# EAGLE board DLT_Jetson_Nano (EAGLE 9.4.2)
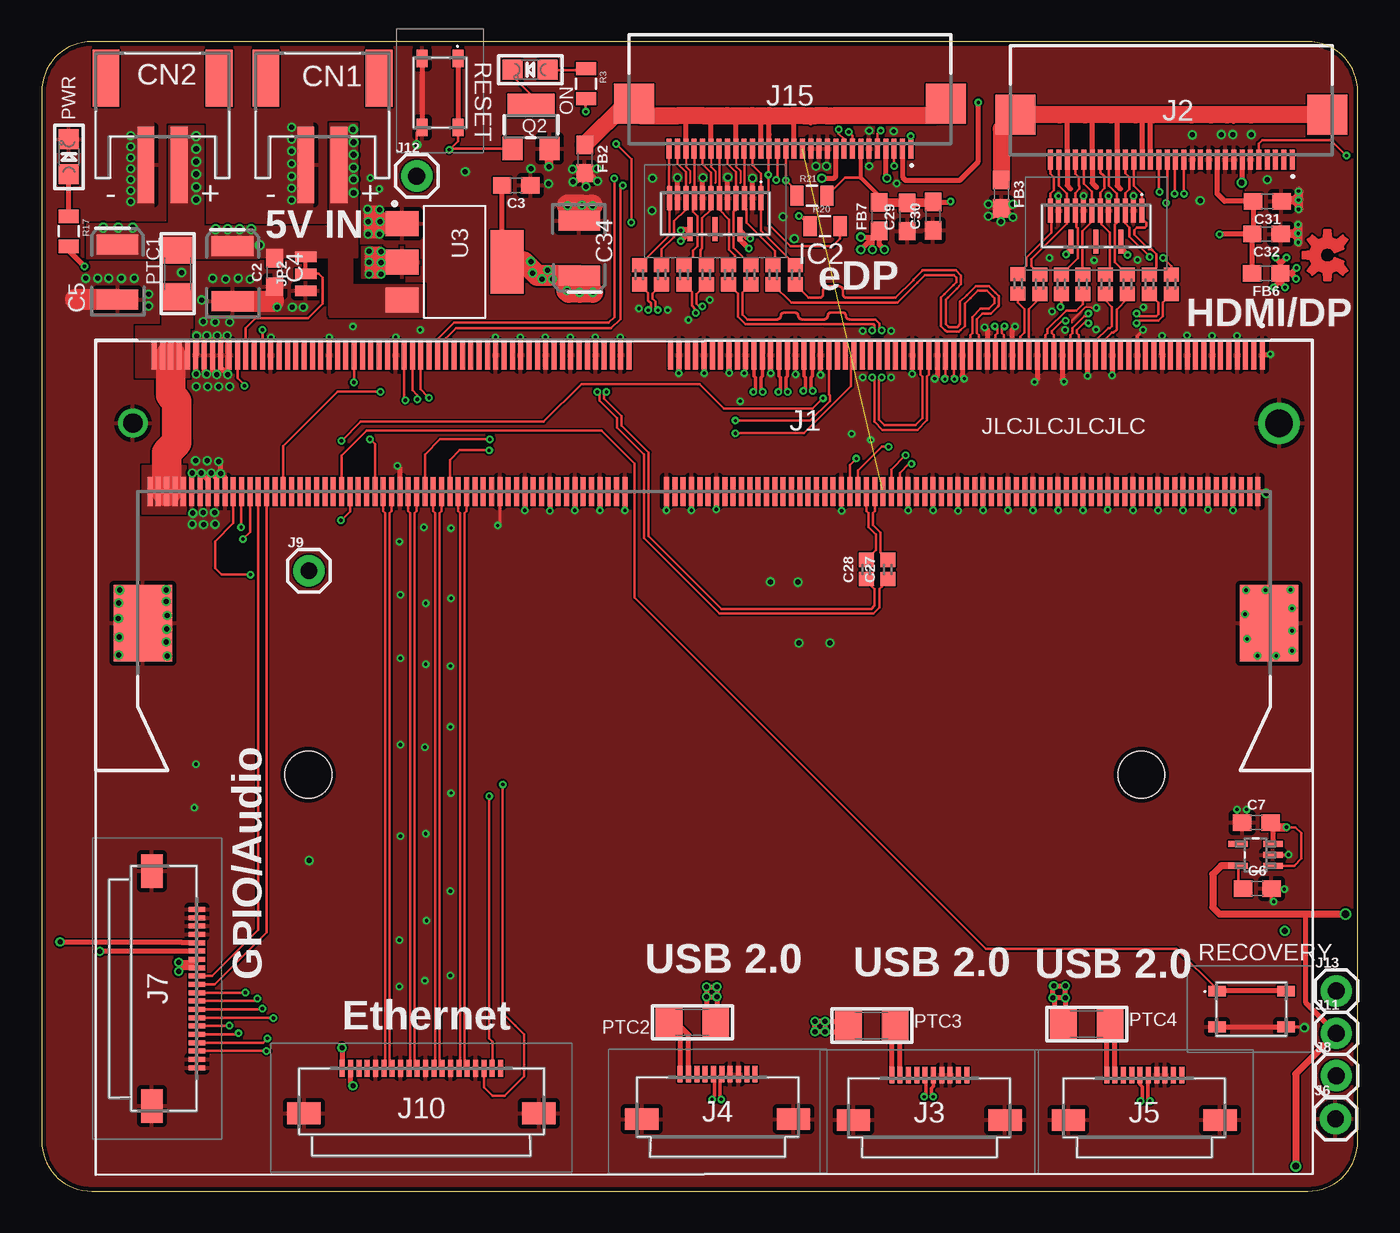
[diagram p2: board, top side]
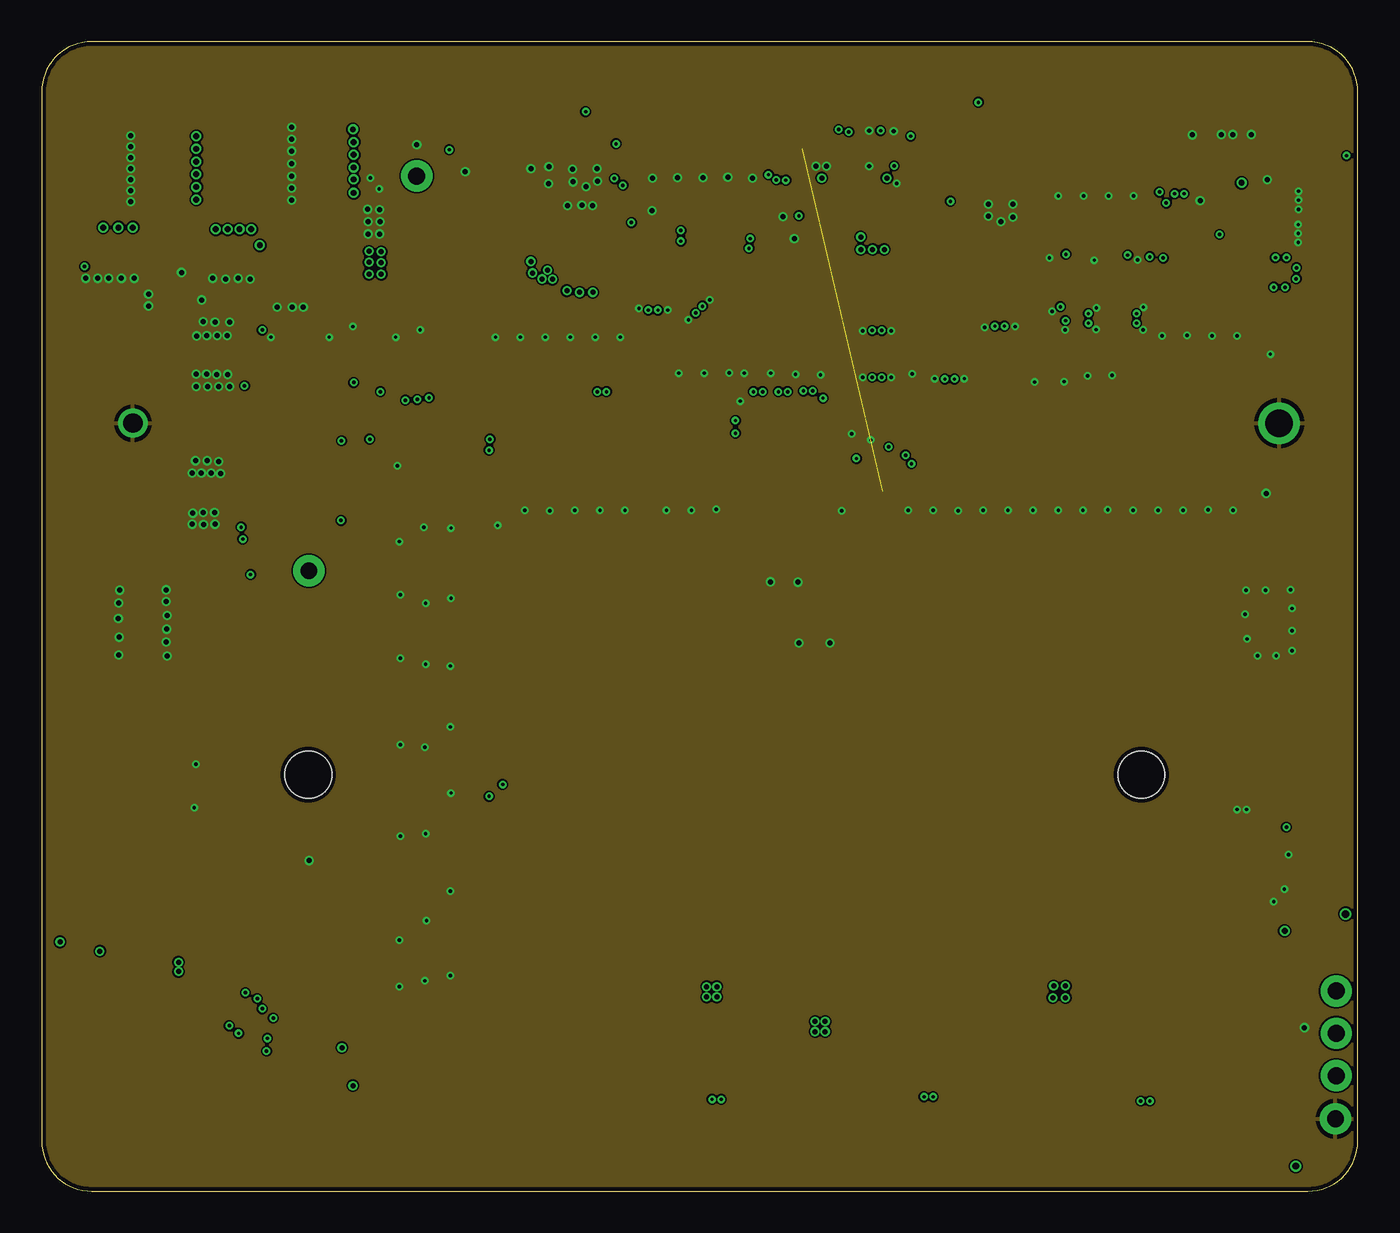
[diagram p3: board, inner layer Route2]
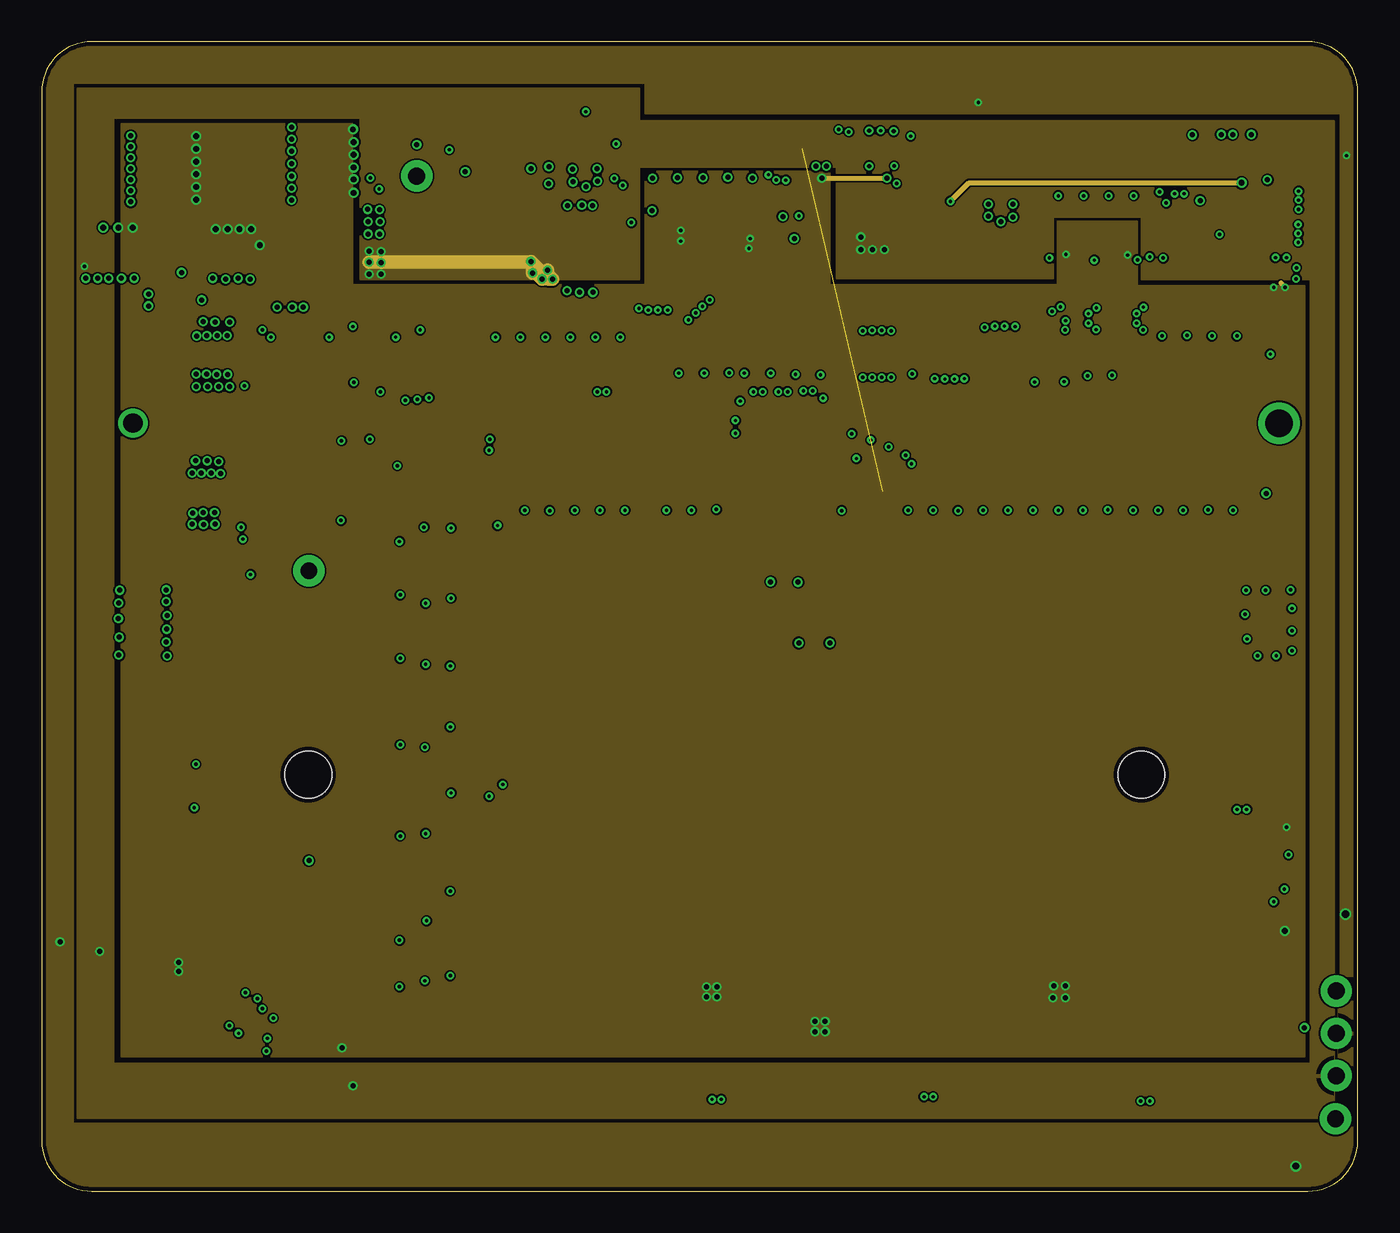
[diagram p4: board, inner layer Route15]
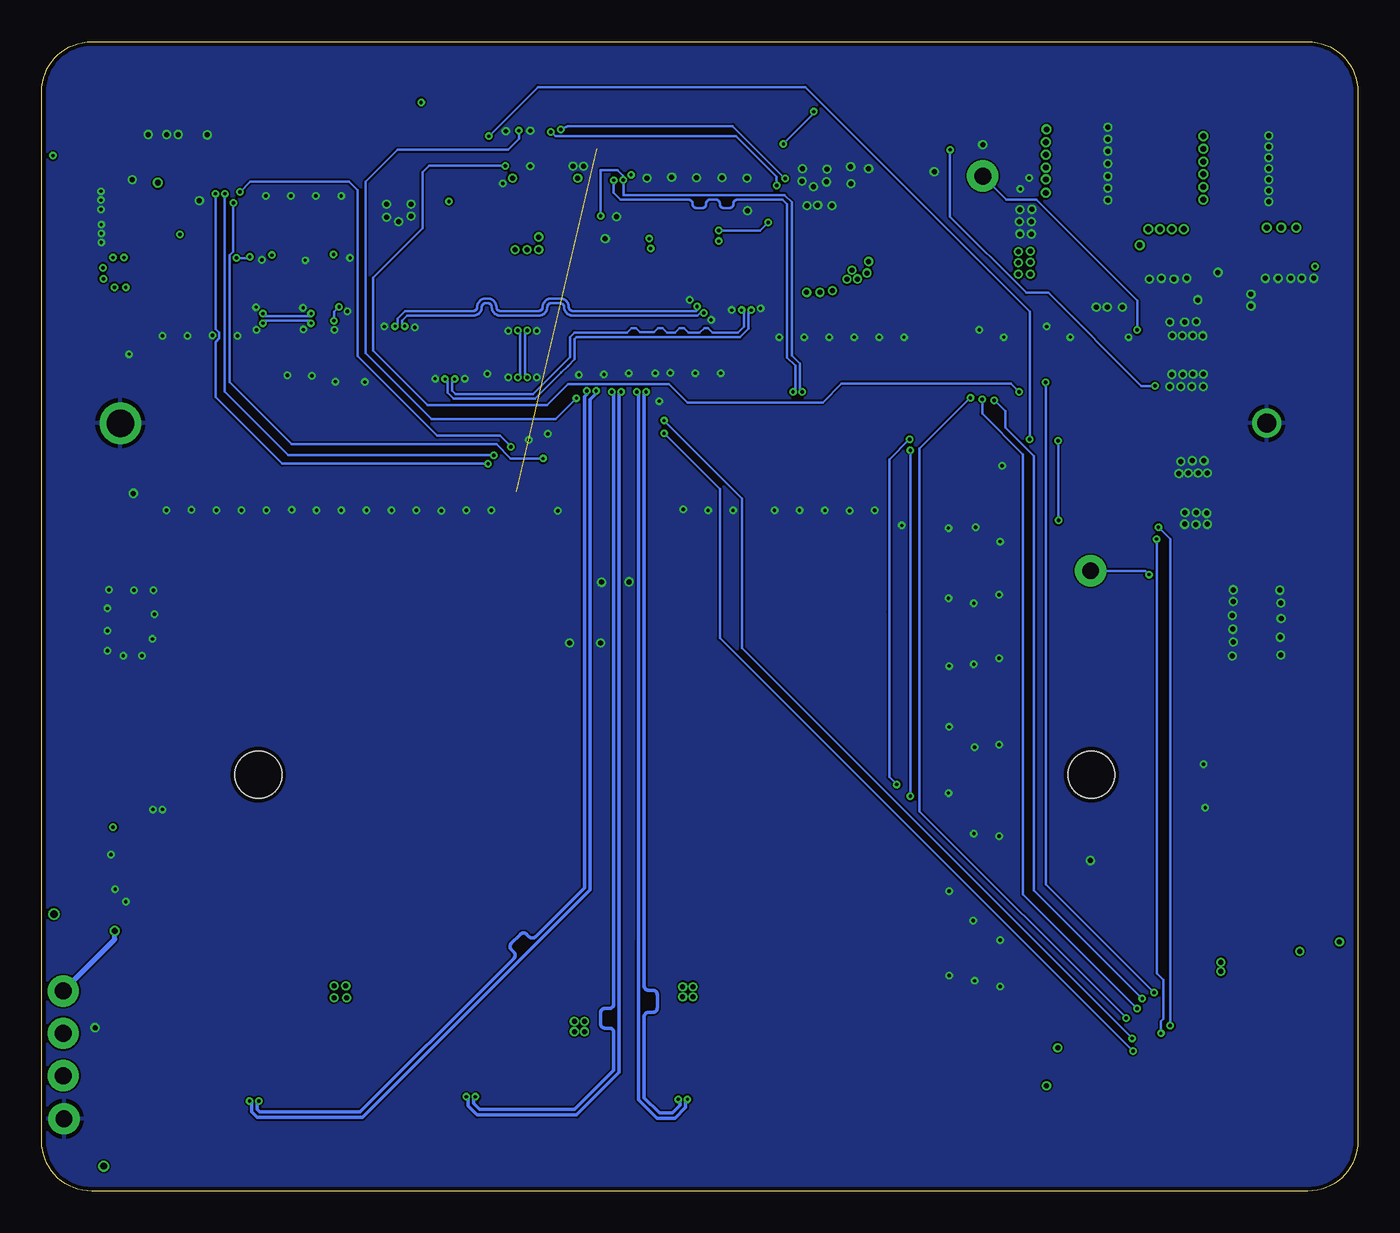
[diagram p5: board, bottom side, seen from below]

Size 79 x 69 mm. Coordinates in mm from the lower left corner, seen from the top.
Outline: 76,69 3,69 arc90 0,66 0,3 arc90 3,0 76,0 arc90 79,3 79,66 arc90 76,69
Copper layers (1+2*15+16): Top 0.035mm / dielectric 0.2mm / Route2 0.0175mm / dielectric 0.265mm / Route15 0.0175mm / dielectric 0.2mm / Bottom 0.035mm
Design rules "SeeedStudio_2layer_DRU_no_angle_20140221 *": minimum track width 4mil, minimum drill 0.2mm, track to track 4mil, track to pad 4mil, pad to pad 4mil, via to via 4mil, smd to smd 0mil, copper to edge 10mil, drill to drill 10mil, minimum pad ring 10mil, minimum via ring 0.125mm, stop-mask expansion 2mil, vias tented up to drill 100mil, thermal gap 10mil
Holes 2.8 mm at 16,25 66,25

## Footprints (pad centres in the part's own frame; a part is rotated, then mirrored left to right if it is on the bottom)
0603 = smd 1.1 x 1: 1 -0.85,0; 2 0.85,0
EIA3528 = smd 1.2 x 2.5: A 1.65,0; C -1.65,0
0402 = smd 0.85 x 0.9: 1 -0.58,0; 2 0.58,0
JST-PH-2-SMT-RA = smd 1 x 4.6: 1 1,-3.7; 2 -1,-3.7 | smd 1.6 x 3.4: NC1 -3.4,1.5; NC2 3.4,1.5
TPD8S009DSMR = smd 0.3 x 1.45: 1 2.75,0.775; 2 2.25,0.775; 3 1.75,0.775; 4 1.25,0.775; 5 0.75,0.775; 6 0.25,0.775; 7 -0.25,0.775; 8 -0.75,0.775; 9 -1.25,0.775; 10 -1.75,0.775; 11 -2.25,0.775; 12 -2.75,0.775; 13 -1.5,-1.075; 14 0,-1.075; 15 1.5,-1.075
SOT65P210X110-5N = smd 1.168 x 0.356: 1 -1.041,0.66; 2 -1.041,0; 3 -1.041,-0.66; 4 1.041,-0.66; 5 1.041,0.66
2309409-1 = smd 0.3 x 1.75: 1 38.25,8.2; 2 38,0; 3 37.75,8.2; 4 37.5,0; 5 37.25,8.2; 6 37,0; 7 36.75,8.2; 8 36.5,0; 9 36.25,8.2; 10 36,0; 11 35.75,8.2; 12 35.5,0; 13 35.25,8.2; 14 35,0; 15 34.75,8.2; 16 34.5,0; 17 34.25,8.2; 18 34,0; 19 33.75,8.2; 20 33.5,0; 21 33.25,8.2; 22 33,0; 23 32.75,8.2; 24 32.5,0; 25 32.25,8.2; 26 32,0; 27 31.75,8.2; 28 31.5,0; 29 31.25,8.2; 30 31,0; 31 30.75,8.2; 32 30.5,0; 33 30.25,8.2; 34 30,0; 35 29.75,8.2; 36 29.5,0; 37 29.25,8.2; 38 29,0; 39 28.75,8.2; 40 28.5,0; 41 28.25,8.2; 42 28,0; 43 27.75,8.2; 44 27.5,0; 45 27.25,8.2; 46 27,0; 47 26.75,8.2; 48 26.5,0; 49 26.25,8.2; 50 26,0; 51 25.75,8.2; 52 25.5,0; 53 25.25,8.2; 54 25,0; 55 24.75,8.2; 56 24.5,0; 57 24.25,8.2; 58 24,0; 59 23.75,8.2; 60 23.5,0; 61 23.25,8.2; 62 23,0; 63 22.75,8.2; 64 22.5,0; 65 22.25,8.2; 66 22,0; 67 21.75,8.2; 68 21.5,0; 69 21.25,8.2; 70 21,0; 71 20.75,8.2; 72 20.5,0; 73 20.25,8.2; 74 20,0; 75 19.75,8.2; 76 19.5,0; 77 19.25,8.2; 78 19,0; 79 18.75,8.2; 80 18.5,0; 81 18.25,8.2; 82 18,0; 83 17.75,8.2; 84 17.5,0; 85 17.25,8.2; 86 17,0; 87 16.75,8.2; 88 16.5,0; 89 16.25,8.2; 90 16,0; 91 15.75,8.2; 92 15.5,0; 93 15.25,8.2; 94 15,0; 95 14.75,8.2; 96 14.5,0; 97 14.25,8.2; 98 14,0; 99 13.75,8.2; 100 13.5,0; 101 13.25,8.2; 102 13,0; 103 12.75,8.2; 104 12.5,0; 105 12.25,8.2; 106 12,0; 107 11.75,8.2; 108 11.5,0; 109 11.25,8.2; 110 11,0; 111 10.75,8.2; 112 10.5,0; 113 10.25,8.2; 114 10,0; 115 9.75,8.2; 116 9.5,0; 117 9.25,8.2; 118 9,0; 119 8.75,8.2; 120 8.5,0; 121 8.25,8.2; 122 8,0; 123 7.75,8.2; 124 7.5,0; 125 7.25,8.2; 126 7,0; 127 6.75,8.2; 128 6.5,0; 129 6.25,8.2; 130 6,0; 131 5.75,8.2; 132 5.5,0; 133 5.25,8.2; 134 5,0; 135 4.75,8.2; 136 4.5,0; 137 4.25,8.2; 138 4,0; 139 3.75,8.2; 140 3.5,0; 141 3.25,8.2; 142 3,0; 143 2.75,8.2; 144 2.5,0; 145 0.25,8.2; 146 0,0; 147 -0.25,8.2; 148 -0.5,0; 149 -0.75,8.2; 150 -1,0; 151 -1.25,8.2; 152 -1.5,0; 153 -1.75,8.2; 154 -2,0; 155 -2.25,8.2; 156 -2.5,0; 157 -2.75,8.2; 158 -3,0; 159 -3.25,8.2; 160 -3.5,0; 161 -3.75,8.2; 162 -4,0; 163 -4.25,8.2; 164 -4.5,0; 165 -4.75,8.2; 166 -5,0; 167 -5.25,8.2; 168 -5.5,0; 169 -5.75,8.2; 170 -6,0; 171 -6.25,8.2; 172 -6.5,0; 173 -6.75,8.2; 174 -7,0; 175 -7.25,8.2; 176 -7.5,0; 177 -7.75,8.2; 178 -8,0; 179 -8.25,8.2; 180 -8.5,0; 181 -8.75,8.2; 182 -9,0; 183 -9.25,8.2; 184 -9.5,0; 185 -9.75,8.2; 186 -10,0; 187 -10.25,8.2; 188 -10.5,0; 189 -10.75,8.2; 190 -11,0; 191 -11.25,8.2; 192 -11.5,0; 193 -11.75,8.2; 194 -12,0; 195 -12.25,8.2; 196 -12.5,0; 197 -12.75,8.2; 198 -13,0; 199 -13.25,8.2; 200 -13.5,0; 201 -13.75,8.2; 202 -14,0; 203 -14.25,8.2; 204 -14.5,0; 205 -14.75,8.2; 206 -15,0; 207 -15.25,8.2; 208 -15.5,0; 209 -15.75,8.2; 210 -16,0; 211 -16.25,8.2; 212 -16.5,0; 213 -16.75,8.2; 214 -17,0; 215 -17.25,8.2; 216 -17.5,0; 217 -17.75,8.2; 218 -18,0; 219 -18.25,8.2; 220 -18.5,0; 221 -18.75,8.2; 222 -19,0; 223 -19.25,8.2; 224 -19.5,0; 225 -19.75,8.2; 226 -20,0; 227 -20.25,8.2; 228 -20.5,0; 229 -20.75,8.2; 230 -21,0; 231 -21.25,8.2; 232 -21.5,0; 233 -21.75,8.2; 234 -22,0; 235 -22.25,8.2; 236 -22.5,0; 237 -22.75,8.2; 238 -23,0; 239 -23.25,8.2; 240 -23.5,0; 241 -23.75,8.2; 242 -24,0; 243 -24.25,8.2; 244 -24.5,0; 245 -24.75,8.2; 246 -25,0; 247 -25.25,8.2; 248 -25.5,0; 249 -25.75,8.2; 250 -26,0; 251 -26.25,8.2; 252 -26.5,0; 253 -26.75,8.2; 254 -27,0; 255 -27.25,8.2; 256 -27.5,0; 257 -27.75,8.2; 258 -28,0; 259 -28.25,8.2; 260 -28.5,0 | drill 1.65 pad 2.5: 261 39.275,4.1 | drill 1.15 pad 1.75: 262 -29.525,4.1 | smd 3.5 x 4.6: 263 38.675,-7.9; 264 -28.925,-7.9
54132-3062 = smd 0.3 x 1.2: 1 -7.25,0.3; 2 -6.75,0.3; 3 -6.25,0.3; 4 -5.75,0.3; 5 -5.25,0.3; 6 -4.75,0.3; 7 -4.25,0.3; 8 -3.75,0.3; 9 -3.25,0.3; 10 -2.75,0.3; 11 -2.25,0.3; 12 -1.75,0.3; 13 -1.25,0.3; 14 -0.75,0.3; 15 -0.25,0.3; 16 0.25,0.3; 17 0.75,0.3; 18 1.25,0.3; 19 1.75,0.3; 20 2.25,0.3; 21 2.75,0.3; 22 3.25,0.3; 23 3.75,0.3; 24 4.25,0.3; 25 4.75,0.3; 26 5.25,0.3; 27 5.75,0.3; 28 6.25,0.3; 29 6.75,0.3; 30 7.25,0.3 | smd 2.4 x 2.4: 31 -9.35,-2.4; 32 9.35,-2.4
5051101092 = smd 0.3 x 1: 1 -2.25,2.475; 2 -1.75,2.475; 3 -1.25,2.475; 4 -0.75,2.475; 5 -0.25,2.475; 6 0.25,2.475; 7 0.75,2.475; 8 1.25,2.475; 9 1.75,2.475; 10 2.25,2.475 | smd 2 x 1.3: 11 -4.55,-0.225; 12 4.55,-0.225
1X01 = drill 1.016 pad 1.88: 1 0,0
5051102091 = smd 0.3 x 1: 1 -4.75,2.625; 2 -4.25,2.625; 3 -3.75,2.625; 4 -3.25,2.625; 5 -2.75,2.625; 6 -2.25,2.625; 7 -1.75,2.625; 8 -1.25,2.625; 9 -0.75,2.625; 10 -0.25,2.625; 11 0.25,2.625; 12 0.75,2.625; 13 1.25,2.625; 14 1.75,2.625; 15 2.25,2.625; 16 2.75,2.625; 17 3.25,2.625; 18 3.75,2.625; 19 4.25,2.625; 20 4.75,2.625 | smd 2 x 1.3: MP1 -7.05,-0.075; MP2 7.05,-0.075
SMT-JUMPER_3_1-NC_TRACE_NO-SILK = smd 0.635 x 1.27: 1 -1.016,0; 2 0,0; 3 1.016,0
CHIPLED_0805 = smd 1.2 x 1.2: A 0,-1.05; C 0,1.05
1206 = smd 1.6 x 1.8: 1 -1.4,0; 2 1.4,0
SOT23-W = smd 1.2 x 1.4: 1 -1.1,-1.3; 2 1.1,-1.3 | smd 2.8 x 1.4: 3 0,1.3
0805 = smd 0.8 x 1.2: 1 -0.9,0; 2 0.9,0
SKRPADE010 = smd 1.05 x 0.65: 1 -1.95,1.075; 2 2.2,1.075; 3 -1.95,-1.075; 4 2.2,-1.075
SOT230P700X180-4N = smd 1.5 x 2: 1 -2.3,-3.15; 2 0,-3.15; 3 2.3,-3.15 | smd 3.8 x 2: 4 0,3.15

## Placement (x,y rotation side)
C2  1uF  [0603]  13.98,55.15 90 top
C3  4.7uF  [0603]  28.48,60.38 180 top
C4  47uF  [EIA3528]  11.47,55.07 90 top
C5  47uF  [EIA3528]  4.56,55.17 90 top
C6  1uF  [0603]  72.96,18.16 0 top
C7  4.7uF  [0603]  72.91,22.13 0 top
C10  0.1uF  [0402]  59.9,54.44 90 top
C11  0.1uF  [0402]  58.61,54.46 90 top
C12  0.1uF  [0402]  62.5,54.44 90 top
C13  0.1uF  [0402]  61.2,54.44 90 top
C14  0.1uF  [0402]  65.16,54.44 90 top
C15  0.1uF  [0402]  63.84,54.44 90 top
C16  0.1uF  [0402]  66.48,54.44 90 top
C17  0.1uF  [0402]  67.8,54.44 90 top
C18  0.1uF  [0402]  43.91,55.01 90 top
C19  0.1uF  [0402]  45.25,55.01 90 top
C20  0.1uF  [0402]  41.23,55.01 90 top
C21  0.1uF  [0402]  42.57,55.01 90 top
C22  0.1uF  [0402]  38.55,55.01 90 top
C23  0.1uF  [0402]  39.89,55.01 90 top
C24  0.1uF  [0402]  35.88,55.01 90 top
C25  0.1uF  [0402]  37.22,55.01 90 top
C27  0.1uF  [0402]  50.79,37.32 90 top
C28  0.1uF  [0402]  49.49,37.32 90 top
C29  4.7uF  [0603]  51.95,58.47 90 top
C30  4.7uF  [0603]  53.5,58.52 90 top
C31  4.7uF  [0603]  73.57,59.41 180 top
C32  4.7uF  [0603]  73.52,57.46 180 top
C34  47uF  [EIA3528]  32.27,56.62 270 top
CN1  [JST-PH-2-SMT-RA]  16.85,65.31 0 top
CN2  [JST-PH-2-SMT-RA]  7.25,65.31 0 top
FB2  .25/3A  [0603]  32.6,61.95 270 top
FB3  .25/3A  [0603]  57.59,59.85 270 top
FB6  .25/3A  [0603]  73.49,55.1 180 top
FB7  .25/3A  [0603]  50.28,58.5 90 top
IC1  TPD8S009DSMR  [TPD8S009DSMR]  63.29,58.07 0 top
IC2  TPD8S009DSMR  [TPD8S009DSMR]  40.42,58.83 0 top
IC3  TLV70018DCKR  [SOT65P210X110-5N]  72.86,20.2 180 top
J1  2309409-1  [2309409-1]  35,42 0 top
J2  54132-3062  [54132-3062]  67.8,62.21 180 top
J3  505110-1092  [5051101092]  53.28,4.5 0 top
J4  505110-1092  [5051101092]  40.58,4.55 0 top
J5  505110-1092  [5051101092]  66.18,4.5 0 top
J6  [1X01]  77.66,4.35 0 top
J7  505110-2091  [5051102091]  6.69,12.17 270 top
J8  [1X01]  77.71,6.94 0 top
J9  [1X01]  16.04,37.24 0 top
J10  505110-2091  [5051102091]  22.8,4.75 0 top
J11  [1X01]  77.71,9.48 0 top
J12  [1X01]  22.52,60.94 0 top
J13  [1X01]  77.71,12.02 0 top
J15  54132-3062  [54132-3062]  44.92,62.87 180 top
JP2  JUMPER-SMT_3_1-NC_TRACE_NO-SILK  [SMT-JUMPER_3_1-NC_TRACE_NO-SILK]  15.86,55.07 90 top
LOGO1  OSHW-LOGOS-COPPER  [OSHW-LOGO-S_COPPER]  77.18,56.19 90 top
ON  [CHIPLED_0805]  29.32,67.31 90 top
PTC1  [1206]  8.16,55.07 90 top
PTC2  [1206]  39.05,10.14 180 top
PTC3  [1206]  49.82,9.93 0 top
PTC4  [1206]  62.72,10.04 0 top
PWR  [CHIPLED_0805]  1.64,62.08 0 top
Q2  [SOT23-W]  29.37,63.88 0 top
R3  [0805]  32.68,66.47 270 top
R17  [0805]  1.64,57.61 270 top
R20  100k  [0805]  47.03,57.92 0 top
R21  100k  [0805]  46.24,59.74 0 top
S2  SKRPADE010  [SKRPADE010]  23.91,66.05 270 top
S4  SKRPADE010  [SKRPADE010]  72.49,10.94 0 top
U3  LDL1117S12R  [SOT230P700X180-4N]  24.78,55.78 270 top

## Tracks (layer width: path | path; a pad name or v marks a point on that pad's centre or on a via)
1.8V  (via drill 0.2, 0.3, 0.4, 0.45)
  Top 0.152: C6.1 71.82,18.46 IC3.5 | J2.5 73.05,62.89 73.27,63.1 77.38,63.1 v78.32,62.16
  Top 0.305: J7.5 8.45,14.92 8.43,14.93 1.1,14.93 v1.1,14.96 | J11.1 75.88,11.31 75.88,16.64 | J15.2 51.67,60.87 51.85,60.68 55.1,60.68 56.22,61.8 v56.22,65.36
  Top 0.406: IC3.5 70.8,19.54 70.29,19.03 70.29,17.05 70.7,16.64 75.88,16.64 v78.27,16.64 | J11.1 75.27,7.04 v75.27,1.5
  pour Route15: 77.96,12.93 77.96,64.7 36.26,64.7 36.26,66.53 1.87,66.53 1.87,4.04 77.86,4.04 77.86,12.73 80.05,12.73 80.05,-2.31 -1.03,-2.31 -1.03,71 80.05,71 80.05,12.93
3.3V  (via drill 0.2, 0.3)
  Top 0.152: v32.3,53.95 32.27,53.98 C34.A
  Top 0.203: U3.4 29.33,55.78 v29.36,55.81
  Top 0.305: J7.6 9.3,14.41 v3.49,14.41 | v18.68,6.33 18.55,6.46 J10.2 | v50.58,56.52 50.28,56.82 50.28,57.58 | 50.28,57.58 FB7.1 50.28,57.64 v49.16,56.52 | v49.87,56.52 49.87,57.18 50.28,57.58 | v49.16,57.28 49.97,57.28 50.28,57.58 | R17.2 1.64,56.44 v2.58,55.5 | U3.4 27.63,56.07 C3.2
  Top 0.508: U3.4 28.62,55.09 28.62,54.22 28.61,54.22 | v20.38,55.73 v20.38,55.05 v19.65,55.05 v19.65,55.76 v19.65,56.42 20.36,56.42 v20.38,56.39 v20.38,55.73
  Top 1.27: U3.2 21.59,55.73 v20.38,55.73 | v33.08,53.95 v32.3,53.95 31.63,53.95 v31.53,54.05 | C34.A 29.75,54.97 28.95,55.78 U3.4
  Route15 0.813: v19.65,55.76 29.31,55.76 v29.36,55.81 | v29.36,55.81 29.46,55.7 v29.46,55.12 29.68,55.12 v30.04,54.76 | v29.36,55.81 30.43,54.74 v30.66,54.74 30.36,55.04 v30.36,55.28
  pour Top: 19.24,56.67 19.24,54.84 22.64,54.84 22.64,56.67
  pour Route15: 35.85,54.74 19.14,54.74 19.14,64.44 4.3,64.44 4.3,7.65 76.19,7.65 76.19,54.74 66.03,54.74 66.03,58.5 60.69,58.5 60.69,54.79 47.74,54.79 47.74,61.5 35.9,61.5 35.9,64.24 77.56,64.24 77.56,4.4 2.17,4.4 2.17,66.17 35.85,66.17
5V  (via drill 0.2, 0.3, 0.35)
  Top 0.152: IC3.1 75.17,19.54 75.6,19.97 75.6,21.49 75.25,21.85 v74.71,21.85 | v35.39,58.14 35.39,61.95 v34.48,62.87 | v32.65,64.8 32.65,65.55 R3.2
  Top 0.305: v38.37,57.66 38.46,57.75 IC2.13 38.92,57.58 v38.37,57.03 | IC2.15 41.92,57.66 | 41.92,57.66 41.92,57.1 42.43,56.59 v42.45,56.59 | v42.53,57.18 42.41,57.18 41.92,57.66 | v74.64,54.26 74.34,54.55 FB6.1 | v73.95,54.26 73.96,54.26 74.34,54.64 FB6.1 | FB6.1 74.97,55.1 v75.3,54.77 | v75.32,55.43 74.99,55.1 FB6.1 | v74.71,56.03 74.34,55.67 | 74.34,55.67 FB6.1 | v74.05,56.03 74.34,55.74 74.34,55.67 | C7.2 73.9,21.99 IC3.3 | J7.8 8.45,13.42 v8.22,13.19 | J7.7 9.09,13.69 8.27,13.69 v8.22,13.74 | v18.02,8.61 18.02,7.4 J10.1 | v40.52,11.66 40.52,10.57 40.26,10.3 | v39.91,11.66 39.91,10.65 40.26,10.3 | 40.26,10.3 40.44,10.12 PTC2.1 | v40.52,11.66 v40.52,12.27 v39.91,12.27 v39.91,11.66 | v39.91,11.66 v40.52,11.66 | v47.03,9.58 48.06,9.58 PTC3.1 48.17,10.19 v47.03,10.19 | v47.03,10.19 v47.03,9.58 | v47.03,9.58 v46.42,9.58 v46.42,10.19 v47.03,10.19 | v60.69,11.61 60.79,11.51 60.79,10.04 PTC4.1 61.45,10.17 v61.45,11.61 | v61.45,11.61 v60.69,11.61 | v60.69,11.61 60.69,12.27 v60.74,12.32 v61.45,12.32 v61.45,11.61 | v61.48,56.24 61.78,56.54 IC1.13 | IC1.15 64.78,56.59 v65.19,56.19 | v46.82,60.81 47.56,60.81 47.67,60.92 J15.10 | v50.73,60.81 50.67,60.88 J15.4
  Top 0.508: v74.71,21.85 74.04,21.85 C7.2
  Route15 0.305: v74.64,54.26 74.38,54.51 | v46.82,60.81 v50.73,60.81
  Bottom 0.152: v38.37,57.66 35.88,57.66 v35.39,58.14 | v34.48,62.87 32.65,64.7 v32.65,64.8
  Bottom 0.305: J13.1 74.61,15.12 v74.61,15.62
  other vias: 3.69,57.84 4.61,57.84 5.47,57.84 9.28,59.52 9.28,60.28 9.28,61.04 9.28,61.8 9.28,62.56 9.28,63.33 18.68,63.73 18.73,62.97 18.73,62.21 18.73,61.45 18.73,59.92 18.73,60.73 13.1,56.78 12.58,57.74 11.87,57.74 11.16,57.74 10.45,57.74
  pour Top (no thermals): 2.73,56.01 12.94,56.01 12.94,57.89 9.69,57.89 9.69,63.93 7.66,63.93 7.66,58.04 2.73,58.04
  pour Top (no thermals): 17.31,64.09 18.93,64.09 18.93,56.06 12.69,56.06 12.69,57.89 17.31,57.89
  pour Route15 (rank 2): 75.78,8.11 4.81,8.11 4.81,64.04 18.63,64.04 18.63,54.38 36.26,54.38 36.26,61.19 47.28,61.19 47.28,54.38 61,54.38 61,58.19 65.72,58.19 65.72,54.33 75.78,54.33
  pour Top (no thermals): 17.26,56.11 18.63,56.11 18.63,54.38 22.95,54.38 22.95,52.5 17.31,52.5 17.31,52.61 17.26,52.61
#PWR_BUTTON  (via drill 0.2)
  Top 0.152: J1.240 11.5,40.09 10.4,38.99 10.4,37.42 10.81,37.01 v12.53,37.01
  Bottom 0.152: v12.53,37.01 12.76,37.24 J9.1
#RECOVERY
  Top 0.152: J1.214 18,44.15 19.49,45.65 33.62,45.65 35.6,43.67 35.6,35.64 56.68,14.56 68.1,14.56 70.65,12.01
  Top 0.305: S4.2 70.65,12.01 S4.1
#RESET  (via drill 0.2)
  Top 0.152: J1.239 11.75,48.82 12.18,48.39 v12.18,48.34 | S2.2 24.98,63.03 v24.47,62.51 24.54,62.58 Q2.1
  Top 0.305: S2.1 S2.2
  Bottom 0.152: v12.18,48.34 12.99,48.34 18.58,53.93 19.91,53.93 24.47,58.49 v24.47,62.51
#SHUTDOWN_REQ  (via drill 0.2)
  Top 0.152: v13.25,51.69 J1.233
  Bottom 0.152: J12.1 21.09,59.52 19.29,59.52 13.25,53.47 v13.25,51.69
AUD_MCLK  (via drill 0.2)
  Top 0.152: J1.211 18.75,48.56 v18.73,48.54 | v12.23,11.92 J7.11
  Bottom 0.152: v18.73,48.54 18.73,18.42 v12.23,11.92
DAP4_DOUT  (via drill 0.2)
  Top 0.152: J1.197 22.25,48.07 22.54,47.78 v22.54,47.53 | v13.25,10.95 13.21,10.92 J7.13
  Bottom 0.152: v22.54,47.53 22.54,46.66 20.1,44.22 20.1,17.81 v13.25,10.95
DAP4_FS  (via drill 0.2)
  Top 0.152: J1.195 22.75,48.13 23.18,47.7 v23.25,47.63 | v13.91,10.39 9.34,10.39 J7.14
  Bottom 0.152: v23.25,47.63 26.3,44.58 26.3,22.79 v13.91,10.39
DAP4_SCLK  (via drill 0.2)
  Top 0.152: J7.12 12.8,11.42 v12.94,11.56 | v21.83,47.48 21.75,47.56 J1.199
  Bottom 0.152: v12.94,11.56 19.44,18.06 19.44,44.12 21.17,45.85 21.17,46.81 v21.83,47.48
DP_GND  (via drill 0.2)
  Top 0.127: J15.22 41.67,61.51 41.93,61.24 41.93,60.53 | J15.25 40.17,61.48 40.43,61.22 40.43,60.53 | J15.28 38.67,61.51 38.91,61.26 38.91,60.53
  Top 0.152: J15.18 43.62,62.52 v43.62,61.01 43.62,58.04 44.94,56.73 47.46,56.73 47.93,57.19 R20.2 47.93,57.95
  Top 0.203: 38.24,64.57 38.17,64.64
  Top 0.305: 36.01,64.67 35.91,64.57 | 41.17,64.54 41.14,64.57 41.67,64.04 J15.22 | 42.67,64.54 42.64,64.57 43.17,64.04 J15.19 | J15.18 43.67,62.54 43.67,63.43 43.67,64.56 43.67,64.57 | 39.67,64.56 39.66,64.57 40.17,64.06 J15.25 | 47.67,64.54 47.64,64.57 | 47.17,64.45 47.05,64.57 | 46.67,64.42 46.52,64.57 46.17,64.22 | 45.07,64.57 45.17,64.47 J15.15 | 45.63,64.57 45.67,64.53 45.71,64.57 46.17,64.11 | 49.67,64.52 49.72,64.57 | 51.17,64.44 51.04,64.57 | J15.28 38.67,64.14 38.24,64.57
  Top 1.016: 35.91,64.57 38.24,64.57 39.66,64.57 41.14,64.57 42.64,64.57 43.67,64.57 45.07,64.57 45.63,64.57 | 35.95,64.73 36.01,64.67 36.01,64.62 | 45.71,64.57 46.52,64.57 47.05,64.57 47.64,64.57 49.72,64.57 51.04,64.57 53.57,64.57 J15.31 | 35.91,64.82 35.91,64.72 36.01,64.62 | 36.01,64.62 36.01,64.83 J15.32 35.06,65.27 FB2.1
DP_PWR_3V3  (via drill 0.2, 0.35)
  Top 0.152: R21.2 48.22,60.83 49.17,60.83
  Top 0.254: FB7.2 50.28,59.46 | 50.28,59.46 50.28,59.72 49.17,60.83 J15.7 | 50.17,59.57 50.28,59.46
  Top 0.305: C30.2 54.51,59.38 v54.55,59.41 | v72.02,60.53 72.05,60.56 J2.7
  Top 0.508: FB7.2 51.93,59.35 C29.2 53.45,59.32 C30.2
  Route15 0.305: v54.55,59.41 55.66,60.53 v72.02,60.53
EDP0_TX_C_N
  Top 0.152: C25.2 37.22,56.53 37.95,57.27 37.95,58.21 38.67,58.93 38.67,59.82 38.67,59.61 IC2.10 38.67,61.16 38.17,61.67 J15.29
EDP0_TX_C_P
  Top 0.152: C24.2 37.67,57.38 IC2.12 37.67,59.61 37.67,61.3 J15.30
EDP0_TX_N  (via drill 0.2)
  Top 0.152: J1.77 54.25,49.02 54.36,48.91 54.36,48.75 v54.21,48.75 | v36.99,52.89 36.84,53.03 36.84,53.41 36.66,53.59 36.66,53.88 C25.1
  Bottom 0.152: v54.21,48.75 54.36,48.6 54.36,48.05 54.16,47.86 49.49,47.86 47.28,50.07 47.28,51.27 47.02,51.54 43.85,51.54 43.6,51.79 43.32,51.79 43.09,51.56 42.25,51.56 42,51.82 41.74,51.82 41.46,51.54 40.98,51.54 40.7,51.82 40.45,51.82 40.17,51.54 39.51,51.54 39.23,51.82 39,51.82 38.72,51.54 37.2,51.54 36.84,51.89 36.84,52.74 v36.99,52.89
EDP0_TX_P  (via drill 0.2)
  Top 0.152: J1.75 54.75,49.02 54.64,48.91 54.64,48.75 v54.79,48.75 | v36.41,52.89 36.56,53.03 36.56,53.29 36.38,53.47 36.38,53.92 C24.1
  Bottom 0.152: v54.79,48.75 54.64,48.6 54.64,47.94 54.28,47.58 49.38,47.58 47.82,49.13 47.41,49.54 47.01,49.94 47,49.95 47,51.16 46.9,51.26 37.08,51.26 36.56,51.78 36.56,52.74 v36.41,52.89
EDP1_TX_C_N
  Top 0.152: C23.2 39.89,55.66 39.53,56.02 39.53,56.49 39.63,56.59 39.63,58.4 40.17,58.93 40.17,59.8 40.17,59.61 IC2.7 40.17,61.14 39.67,61.64 J15.26
EDP1_TX_C_P
  Top 0.152: C22.2 39.09,56.12 39.09,56.45 39.36,56.72 39.36,58.52 39.09,58.78 39.09,59.52 IC2.9 J15.27
EDP1_TX_N  (via drill 0.2)
  Top 0.152: J1.63 57.75,51.38 57.64,51.49 57.64,51.92 v57.79,51.92 | v39.66,53.12 39.45,53.12 39.3,53.27 39.3,53.84 C23.1
  Bottom 0.152: v57.79,51.92 57.64,52.07 57.64,52.37 57.17,52.83 53.1,52.83 arc-90 52.86,53.07 arc90 52.35,53.58 52.22,53.58 arc90 51.71,53.07 arc-90 51.47,52.83 49.17,52.83 arc-90 48.93,53.07 arc90 48.42,53.58 47.88,53.58 arc90 47.36,53.07 arc-90 47.13,52.83 39.74,52.83 39.61,52.96 39.61,53.06 v39.66,53.12
EDP1_TX_P  (via drill 0.2)
  Top 0.152: J1.65 57.25,51.38 57.36,51.49 57.36,51.92 v57.21,51.92 | v39.26,52.71 39.26,52.92 39.03,53.15 39.03,53.95 C22.1
  Bottom 0.152: v57.21,51.92 57.36,52.07 57.36,52.25 57.06,52.56 53.1,52.56 arc-90 52.58,53.07 arc90 52.35,53.31 52.22,53.31 arc90 51.99,53.07 arc-90 51.47,52.56 49.17,52.56 arc-90 48.65,53.07 arc90 48.42,53.31 47.88,53.31 arc90 47.64,53.07 arc-90 47.13,52.56 39.62,52.56 39.41,52.76 39.31,52.76 v39.26,52.71
EDP2_TX_C_N
  Top 0.152: C21.2 41.54,56.62 41.54,58.8 41.69,58.95 41.69,59.87 41.69,59.62 IC2.4 41.67,61.16 41.17,61.67 J15.23
EDP2_TX_C_P
  Top 0.152: C20.2 41.33,55.59 41.61,55.87 41.61,56.14 41.26,56.5 41.26,58.33 40.67,58.91 IC2.6 J15.24
EDP2_TX_N  (via drill 0.2)
  Top 0.152: v50.43,51.67 50.28,51.81 50.28,52.09 50.04,52.33 48.5,52.33 arc-90 48.27,52.56 arc90 48.08,52.75 47.37,52.75 arc90 47.19,52.56 arc-90 46.95,52.33 45.64,52.33 arc-90 45.41,52.56 arc90 45.25,52.72 44.52,52.72 arc90 44.37,52.56 arc-90 44.13,52.33 42.35,52.33 42.07,52.61 42.07,53.93 C21.1 | J1.83 52.75,49.02 52.86,48.91 52.86,46.4 52.44,45.98 50.58,45.98 50.25,46.31 50.25,48.67 v50.43,48.85
  Bottom 0.152: v50.43,48.85 50.28,49 50.28,51.52 v50.43,51.67
EDP2_TX_P  (via drill 0.2)
  Top 0.152: v49.85,51.67 50,51.81 50,51.97 49.92,52.05 48.5,52.05 46.95,52.05 45.64,52.05 44.13,52.05 42.24,52.05 41.79,52.49 41.79,53.86 C20.1 | J1.81 53.25,49.02 53.14,48.91 53.14,46.28 52.55,45.7 50.47,45.7 49.97,46.19 49.97,48.72 v49.85,48.85
  Bottom 0.152: v49.85,48.85 50,49 50,51.52 v49.85,51.67
EDP3_TX_C_N
  Top 0.152: IC2.1 43.19,59.62 | IC2.1 43.17,57.66 C19.2 | IC2.1 43.17,61.08 42.67,61.59 J15.20
EDP3_TX_C_P
  Top 0.152: C18.2 44,55.59 44,56.42 42.3,58.12 42.3,58.94 42.17,59.07 IC2.3 42.17,60.94 J15.21
EDP3_TX_N
  Top 0.152: J1.69 56.25,51.38 56.14,51.49 56.14,52.35 56.47,52.68 56.65,52.68 56.97,52.68 57.38,53.09 57.47,53.18 57.47,53.71 57.26,53.92 56.84,54.33 56.55,54.33 56.08,54.33 55.54,53.8 55.13,53.38 55.13,53.06 55.13,52.25 55.13,52.05 54.95,51.87 54.44,51.87 54.42,51.89 54.27,52.05 54.27,52.4 54.27,53.52 54.39,53.65 54.93,54.18 55.18,54.44 55.18,54.84 55.18,54.96 54.86,55.27 52.87,55.27 52.87,55.26 52.31,54.7 52.31,54.69 51.24,53.62 48.32,53.62 arc-90 48.09,53.86 48.09,54.08 arc90 47.85,54.31 47.14,54.31 arc90 46.91,54.08 46.91,53.86 arc-90 46.67,53.62 46.04,53.62 45.25,54.41 C19.1
EDP3_TX_P
  Top 0.152: J1.71 55.75,51.38 55.86,51.49 55.86,52.35 55.86,52.47 56.35,52.96 56.65,52.96 56.86,52.96 57.19,53.29 57.19,53.6 57.06,53.72 56.73,54.05 56.55,54.05 56.2,54.05 55.74,53.6 55.41,53.27 55.41,53.06 55.41,52.25 55.41,51.93 55.15,51.67 55.07,51.59 54.33,51.59 54.22,51.7 53.99,51.93 53.99,52.4 53.99,53.64 54.19,53.84 54.73,54.38 54.9,54.55 54.9,54.84 54.75,54.99 53.02,54.99 52.56,54.54 52.56,54.55 51.36,53.34 48.32,53.34 46.67,53.34 44.99,53.34 C18.1
EDP_AUX_C_N  (via drill 0.2)
  Top 0.152: v33.9,47.98 33.77,47.98 33.77,47.57 34.81,46.53 34.81,45.97 36.44,44.34 36.44,39.32 40.8,34.95 49.8,34.95 50,35.16 50,36.13 49.85,36.29 49.85,36.38 C28.1 | J15.16 v44.66,60.68 45.34,60.01 R21.1
  Bottom 0.152: v33.9,47.98 33.77,48.12 33.77,49.56 34.25,50.04 34.25,59.24 34.53,59.52 37.24,59.52 arc-90 37.48,59.28 37.48,59.25 arc90 37.71,59.01 38.06,59.01 arc90 38.3,59.25 38.3,59.28 arc-90 38.53,59.52 38.88,59.52 arc-90 39.12,59.28 39.12,59.25 arc90 39.35,59.01 39.7,59.01 arc90 39.93,59.25 39.93,59.28 arc-90 40.17,59.52 44.26,59.52 44.66,59.92 v44.66,60.68
EDP_AUX_C_P  (via drill 0.2)
  Top 0.152: C27.1 50.43,36.38 50.43,36.29 50.28,36.13 50.28,35.04 49.91,34.67 40.69,34.67 36.16,39.21 36.16,44.22 34.53,45.85 34.53,46.41 33.49,47.45 33.49,47.98 v33.35,47.98 | 46.13,58.07 R20.1 45.49,58.55 v45.45,58.55 | v44.09,60.7 44.17,60.78 J15.17
  Bottom 0.152: v33.35,47.98 33.49,48.12 33.49,49.67 33.97,50.16 33.97,59.35 34.41,59.8 44.07,59.8 44.07,60.68 v44.09,60.7 44.09,60.95 44.44,61.29 45.45,61.29 v45.45,58.55
EDP_AUX_N
  Top 0.152: J1.96 49.5,40.82 49.61,40.71 49.61,39.87 50.08,39.41 50.08,38.48 C28.2
EDP_AUX_P
  Top 0.152: J1.94 50,40.82 49.89,40.71 49.89,39.99 50.35,39.52 50.35,38.33 C27.2
EDP_HPD  (1 unrouted)
ENET_LED0  (via drill 0.2)
  Top 0.152: J1.194 23,44.23 23.91,45.14 v26.91,45.14 | v27.67,24.41 27.67,10.7 28.43,9.93 28.94,9.43 28.94,6.89 27.77,5.72 27.06,5.72 26.55,6.23 J10.18
  Bottom 0.152: v26.91,45.14 28.13,43.92 28.13,34.78 28.13,24.87 v27.67,24.41
ENET_LED1  (via drill 0.2)
  Top 0.152: J1.188 24.5,43.9 25.08,44.48 v26.86,44.48 | v26.86,23.7 26.86,9.17 27.06,8.97 27.06,7.39 J10.19
  Bottom 0.152: v26.86,44.48 v26.86,23.7
ENET_TRD0_N
  Top 0.152: J1.202 21,40.82 20.89,40.71 20.89,7.53 J10.7
ENET_TRD0_P
  Top 0.152: J1.204 20.5,40.82 20.61,40.71 20.61,7.44 J10.6
ENET_TRD1_N
  Top 0.152: J1.196 22.5,40.82 22.39,40.71 22.39,7.53 J10.10
ENET_TRD1_P
  Top 0.152: J1.198 22,40.82 22.11,40.71 22.11,8.87 22.11,7.44 J10.9
ENET_TRD2_N
  Top 0.152: J1.190 24,40.82 23.89,40.71 23.89,7.53 J10.13
ENET_TRD2_P
  Top 0.152: J1.192 23.5,40.82 23.61,40.71 23.61,7.44 J10.12
ENET_TRD3_N
  Top 0.152: J1.186 25,40.82 25.11,40.71 25.11,7.44 J10.15
ENET_TRD3_P
  Top 0.152: J1.184 25.5,40.82 25.39,40.71 25.39,7.53 J10.16
GEN2_I2C_SCL  (via drill 0.2)
  Top 0.152: J1.189 24.27,50.22 24.27,51.2 24.86,51.79 34.17,51.79 34.73,52.35 34.73,53.57 34.73,60.23 v34.89,60.38 | v48.45,63.58 48.67,63.36 J15.8
  Bottom 0.152: v34.89,60.38 34.89,60.89 37.32,63.33 48.14,63.33 48.4,63.58 v48.45,63.58
GEN2_I2C_SDA  (via drill 0.2)
  Top 0.152: J1.191 23.77,50.22 23.77,51.15 24.74,52.12 34.02,52.12 34.38,52.48 v34.38,60.78 | v47.84,63.73 47.84,63.48 48.15,63.18 48.16,62.89 48.17,62.88 J15.9
  Bottom 0.152: v34.38,60.78 37.53,63.94 47.43,63.94 v47.84,63.73
GEN3_I2C_SCL
  Top 0.152: J7.9 9.34,12.94 10.25,12.94 13,15.69 J1.234
GEN3_I2C_SDA
  Top 0.152: J7.10 10.4,12.42 13.5,15.52 J1.232
GND  (via drill 0.2, 0.25, 0.3, 0.3 pad 0.55)
  Top 0.102: v63.31,53.01 63.03,53.01 62.98,53.06 62.64,53.06 61.83,52.25 61.83,52.1
  Top 0.152: v52.26,49.05 v52.25,49.06 J1.85 | 53.75,50.24 J1.79 | 56.75,50.32 J1.67 | J1.141 38.25,49.11 v38.24,49.1 | J1.135 39.75,49.11 v39.76,49.1 | J1.129 v41.25,49.14 v41.26,49.13 | J1.125 42.25,49.18 v42.17,49.1 | J1.119 v43.75,49.1 | v43.75,49.1 | J1.113 v45.25,49.03 | J1.107 v46.75,49 | J1.102 48,40.86 v48.02,40.85 | J1.86 v52,40.88 v52,40.87 | J1.80 v53.5,40.88 v53.5,40.87 | J1.74 v55,40.85 | J1.68 v56.5,40.87 | J1.62 v58,40.87 | v58,40.87 | J1.56 v59.5,40.87 | J1.50 61,40.89 v61.02,40.87 | J1.44 v62.5,40.88 v62.5,40.87 | J1.38 v64,40.9 v63.99,40.9 | J1.32 65.5,40.89 v65.52,40.87 | J1.26 67,40.89 v67.02,40.87 | J1.20 68.5,40.89 v68.52,40.87 | J1.14 70,40.91 v70.01,40.9 | J1.8 71.5,40.88 v71.51,40.87 | IC3.2 v74.84,20.2 | v72.33,22.91 72.33,22.39 C7.1 71.74,22.45 v71.74,22.91 | v73.95,17.38 73.81,17.52 C6.2 73.84,18.14 v74.59,18.14 | v75.42,56.95 74.92,57.46 C32.1 74.86,57.46 v75.42,58.02 | v75.45,58.93 74.97,59.41 C31.1 74.84,59.41 v75.45,60.02 | S4.4 75.75,9.86 v75.8,9.82 | v22.52,62.82 22.52,63.53 S2.4 | J1.264 6.44,33.73 v7.5,33.73 | J1.176 27.5,40.09 v27.37,39.96 | v39,40.87
  Top 0.203: v66.1,51.69 65.75,51.34 J1.31
  Top 0.305: v9.31,51.34 9.31,50.26 J1.249 9.25,49.08 v9.28,49.05 | v9.92,51.36 9.75,51.19 J1.247 9.75,49.19 v9.89,49.05 | v10.53,51.36 10.25,51.08 J1.245 10.25,49.28 v10.5,49.03 | v10.63,43.79 10.73,43.69 v10.73,43.08 11,42.81 J1.242 | J1.244 10.5,42.78 v10.17,43.11 | J1.246 10,42.69 v9.59,43.11 | J1.248 9.5,43.07 9.46,43.11 v9.03,43.11 9,43.08 J1.250 | IC2.2 42.67,60.8 v42.66,60.81 | IC2.5 v41.17,60.85 v41.19,60.86 | IC2.8 39.67,60.82 v39.69,60.84 | IC2.11 38.17,60.83 v38.16,60.84 | J1.200 21.5,43.39 v21.35,43.54 | J1.170 v29,40.88 v28.99,40.87 | J1.164 v30.5,40.86 v30.49,40.85 | J1.158 32,40.88 v31.99,40.87 | J1.152 33.5,40.89 v33.51,40.87 | J1.146 35,40.88 v35.01,40.87 | J1.37 v64.25,48.98 v64.25,48.97 | J1.43 62.75,48.97 v62.78,48.95 | J1.49 61.25,48.72 v61.38,48.59 | J1.55 59.75,48.72 v59.6,48.57 | J1.61 58.25,51.71 v58.43,51.89 | J1.73 55.25,48.9 v55.38,48.77 | v56.6,51.84 56.75,51.7 56.75,50.32 | 53.75,50.24 53.75,48.92 v53.61,48.77 | J1.25 v67.25,51.34 | v68.74,51.36 v68.75,51.36 J1.19 | v70.24,51.34 70.25,51.33 J1.13 | v71.74,51.34 71.75,51.33 J1.7 | v73.75,50.24 73.7,50.2 J1.1 | J1.2 73.38,42 v73.49,41.89 | v58.3,59.24 58.06,59 FB3.2 | v56.83,59.24 57.35,59.24 FB3.2 | v56.83,58.53 57.12,58.53 57.51,58.91 | 57.51,58.91 FB3.2 | v57.57,58.19 57.51,58.25 57.51,58.91 | v58.3,58.47 57.87,58.91 57.51,58.91 | J1.177 v27.25,51.25 v27.24,51.26 | J1.147 34.75,51.24 v34.73,51.26 | v13.75,51.26 J1.231 | v17.26,51.26 J1.217 | v21.25,51.26 J1.201 | v30.24,51.26 30.25,51.25 J1.165 | v33.23,51.26 33.25,51.25 J1.153 | v31.74,51.26 31.75,51.25 J1.159 | J1.132 v40.5,40.92 | J1.138 v39,40.87 | J1.144 v37.5,40.87 | v31.86,61.34 32.36,61.34 FB2.2
  Top 0.305: v31.89,60.58 32.08,60.58 FB2.2 | v32.68,60.3 32.6,60.38 FB2.2 | v33.36,60.63 32.89,61.1 32.83,61.1 | 32.83,61.1 FB2.2 | v33.34,61.37 33.09,61.37 32.83,61.1 | S2.3 S2.4 | S4.3 S4.4 | IC1.8 62.54,59.73 v62.55,59.74 | IC1.5 v64.04,59.73 v64.05,59.74 | IC1.11 61.04,59.73 v61.02,59.74 | IC1.2 v65.54,59.74 | J1.171 28.74,50.21 v28.74,51.26 | J1.243 10.75,50.97 v11.14,51.36 11.14,50.31 J1.241 11.16,50.11 v11.16,49.03 10.75,49.44 J1.243
  Top 0.508: 20.42,58.08 v20.31,58.19 | v20.31,58.19 20.28,58.22 v20.28,58.91 19.59,58.91 | v19.57,58.93 19.59,58.91 | 19.59,58.91 v19.59,58.19 v19.59,57.46 v20.28,57.46 20.31,57.48 v20.31,58.19 | v30.44,61.5 30.44,62.55 Q2.2 30.47,62.4 | C31.1 74.5,59.49 v75.45,59.49 | v75.45,59.49 v75.45,60.02 | v75.45,59.49 v75.45,58.93 | C32.1 74.39,57.48 v75.42,57.48 | v75.42,57.48 v75.42,58.02 | v75.42,57.48 v75.42,56.95 | J1.263 74.14,33.63 v75.04,33.63
  Top 1.27: U3.1 20.42,58.08 20.28,58.22 | v33.06,59.16 33.03,59.19 v32.42,59.19 31.58,59.19 v31.56,59.16 | C4.C 13.91,53.42 13.91,53.52 | C5.C 2.02,53.52
  other vias: 36.64,58.85 45.17,57.18 36.66,60.81 44.49,58.5 4.63,32.18 4.66,33.25 4.61,34.37 4.63,35.31 4.68,36.07 7.48,36.1 7.48,35.39 7.53,34.55 7.48,32.97 7.53,32.13 9.08,40.69 9.69,40.74 10.37,40.74 43.75,36.58 45.45,32.91 47.31,32.91 45.4,36.55 16.05,19.84 25.43,61.2 72.3,36.07 73.47,36.07 74.97,36.1 75.04,34.98 75.04,32.44 74.1,32.13 72.99,32.13 72.35,33.15 72.22,34.62 50.99,48.85 49.29,48.85 49.29,51.64 50.99,51.64 41.92,47.42 35.85,52.99 37.58,52.89 18.68,51.9 22.72,51.69 19.72,60.81 20.26,60.15 63.28,51.72 60.64,52.81 61.43,51.69 66.13,53.06 48.63,45.47 49.77,45.09 40.09,53.5 38.82,52.3 9.16,23.02 9.26,25.63 8.39,55.15 15,59.49 15,60.2 15,60.91 15,61.67 15,62.44 15,63.15 15,63.86 5.35,59.39 5.35,60.05 5.35,60.71 5.35,61.37 5.35,62.03 5.35,62.69 5.35,63.35 9.61,53.5 6.41,53.14 6.41,53.85 10.27,54.79 11.04,54.74 11.8,54.79 12.51,54.74 3.36,54.79 4.02,54.79 4.79,54.79 5.55,54.79 2.65,54.79 15.71,53.06 15.05,53.06 14.13,53.06 22.95,39.86 24.57,39.8 24.57,35.59 24.52,31.52 24.52,27.87 24.57,23.9 24.52,18.01 24.52,12.93 23,12.63 23.1,16.23 23.05,21.47 23,26.65 23.05,31.63 23.05,35.28 21.47,38.99 21.53,35.79 21.53,31.98 21.53,26.8 21.53,21.31 21.47,12.27 21.47,15.07 29.36,61.38 30.43,60.47 46.47,61.52 47.1,61.52 49.67,61.52 51.32,60.48 49.67,63.66 51.14,63.63 69.07,63.4 70.8,63.43 71.49,63.43 72.6,63.43 69.53,59.46 73.57,60.71 11.29,48.29 10.63,48.29 9.97,48.29 9.28,48.29 9.69,52.2 10.4,52.17 11.29,52.17 9.94,43.84 9.23,43.84 9.03,40.03 9.71,40.01 10.4,40.03 63.18,55.88 65.77,55.91 60.49,56.01
  pour Top: 8.93,43.67 11.11,43.67 11.11,40.39 8.93,40.39
  pour Top (rank 2): -2.46,71.01 81.97,71.01 81.97,-4.01 -2.46,-4.01
  pour Bottom: -3.71,72.28 83.95,72.28 83.95,-5.84 -3.71,-5.84
  pour Route2: 86.41,74.05 -5.74,74.05 -5.74,-8.69 86.41,-8.69
  pour Top (no thermals): 5.07,64.09 5.07,58.96 6.69,58.96 6.69,64.09
  pour Top (no thermals): 14.62,64.14 14.62,59.11 16.24,59.11 16.24,64.14
  pour Top: 19.24,57.23 19.24,59.16 22.19,59.16 22.74,59.16 22.74,57.23
GPIO13_PE6_PWM  (via drill 0.2)
  Top 0.152: J1.228 14.5,44.72 17.77,47.98 v20.33,47.98 | v51.17,61.54 J15.3
  Bottom 0.152: v20.33,47.98 20.81,48.47 31,48.47 32.12,47.35 40.24,47.35 41.33,48.44 47.41,48.44 48.65,47.2 55.84,47.2 59.09,50.45 59.09,54.84 56.12,57.81 56.12,61.17 55.75,61.54 v51.17,61.54
HDMI_CEC  (via drill 0.2)
  Top 0.152: J1.90 51,43.32 v51.85,44.17 | v68.01,59.87 68.01,61.86 J2.15
  Bottom 0.152: v51.85,44.17 64.2,44.17 68.01,47.98 v68.01,59.87
HDMI_GND
  Top 0.305: 61.05,64.61 61.1,64.61 61.55,64.15 J2.28 61.55,60.36 61.76,60.15 | 62.55,64.61 62.62,64.61 63.05,64.18 J2.25 63.05,60.51 63.31,60.25 | 64.05,64.61 64.2,64.61 64.55,64.25 J2.22 64.55,60.35 64.76,60.15 | 65.55,64.61 65.67,64.61 66.05,64.22 J2.19 | J2.18 66.55,64.61 66.69,64.61 | 69.05,64.58 69.02,64.61 | 70.05,64.47 70.19,64.61 | 71.05,64.5 71.16,64.61 71.55,64.21 | 72.55,64.58 72.58,64.61
  Top 1.016: J2.31 72.58,64.61 71.16,64.61 70.19,64.61 69.02,64.61 66.69,64.61 65.67,64.61 64.2,64.61 62.62,64.61 61.1,64.61 J2.32 57.59,63.75 FB3.1
HDMI_HPD  (via drill 0.2)
  Top 0.152: J1.88 51.5,43.11 52.06,43.67 v52.21,43.67 | v68.57,59.87 68.55,59.88 J2.14
  Bottom 0.152: v52.21,43.67 64.55,43.67 68.57,47.68 68.57,50.97 68.34,51.19 68.34,51.53 68.57,51.75 v68.57,59.87
HDMI_PWR_5V  (via drill 0.2)
  Top 0.305: J2.10 70.55,59.86 71,59.41 C31.2 72.72,57.51 C32.2 | C32.2 72.64,57.43 FB6.2 | C32.2 70.88,57.46 70.85,57.43 v70.7,57.43
HDMI_SCL  (via drill 0.2)
  Top 0.152: J2.16 67.55,59.37 v67.5,59.31 | v48.9,43.98 48.5,43.58 J1.100
  Bottom 0.152: v67.5,59.31 67.5,56.4 67.72,56.18 67.72,48.56 63.99,44.83 51.7,44.83 50.84,43.98 v48.9,43.98
HDMI_SDA  (via drill 0.2)
  Top 0.152: J1.98 49,43.25 50.43,44.68 v50.84,44.68 | v67.09,59.97 67.05,60.01 J2.17
  Bottom 0.152: v50.84,44.68 51.5,45.34 55.26,45.34 60.03,50.12 60.03,60.07 60.54,60.58 66.48,60.58 v67.09,59.97
LCD_BL_EN  (via drill 0.2)
  Top 0.152: J1.212 18.5,40.79 v17.97,40.26 | v17.99,45.04 19.14,46.18 30.14,46.18 32.4,48.44 39.48,48.44 40.96,46.97 46.27,46.97 v46.9,47.6 | v50.35,63.66 50.17,63.47 J15.5
  Bottom 0.152: v17.97,40.26 17.97,45.01 v17.99,45.04 | v46.9,47.6 48.17,46.33 55.59,46.33 59.55,50.3 59.55,60.61 57.64,62.51 51.02,62.51 50.35,63.17 v50.35,63.66
LCD_BL_PWM  (via drill 0.2)
  Top 0.152: J15.1 52.17,63.31 v52.16,63.33 | J1.206 20,44.83 v19.7,45.14
  Bottom 0.152: v52.16,63.33 49.21,66.27 33.16,66.27 19.7,52.81 v19.7,45.14
N$6
  Top 0.152: ON.C 28.27,66.87 28.29,66.89 29.37,65.81 Q2.3
N$9
  Top 0.152: R3.1 32.57,67.27 30.98,67.27 30.4,67.29 ON.A
N$14
  Top 0.305: R17.1 PWR.A
PWR_EN
  Top 0.152: J1.237 12.25,51.81 12.84,52.4 15.99,52.4 16.85,53.27 16.85,54.84 16.63,55.07 15.89,55.07 | 15.89,55.07 15.53,55.07 | JP2.2 15.89,55.07
TMDS_CLK_C_N
  Top 0.152: C16.2 66.92,55.45 66.92,56.25 66.68,56.49 66.67,56.49 66.61,56.54 66.45,56.54 65.59,57.4 65.59,57.68 65.75,57.84 66.23,57.84 66.31,57.92 66.31,58.14 66.04,58.41 IC1.1 66.04,59.89 65.55,60.37 J2.20
TMDS_CLK_C_P  (via drill 0.2)
  Top 0.152: C17.2 67.8,55.52 v67.32,56.01 | v66.51,56.09 65.29,57.31 65.29,57.84 65.03,58.09 IC1.3 65.04,59.9 65.29,60.15 65.29,60.24 65.28,60.25 65.28,60.88 65.05,61.1 J2.21
  Bottom 0.152: v67.32,56.01 66.59,56.01 v66.51,56.09
TMDS_CLK_N  (via drill 0.2)
  Top 0.152: J1.47 61.75,51.38 61.86,51.49 61.86,51.81 62.58,52.53 62.83,52.53 v62.83,52.68 | v65.72,52.68 65.87,52.53 66.92,52.53 67.02,52.63 67.02,53.32 C16.1
  Bottom 0.152: v62.83,52.68 62.97,52.53 65.57,52.53 v65.72,52.68
TMDS_CLK_P  (via drill 0.2)
  Top 0.152: J1.45 62.25,51.38 62.14,51.49 62.14,51.69 62.7,52.25 62.83,52.25 v62.83,52.1 | v65.72,52.1 65.87,52.25 67.03,52.25 67.3,52.52 67.3,53.35 C17.1
  Bottom 0.152: v62.83,52.1 62.97,52.25 65.57,52.25 v65.72,52.1
TMDS_D0_C_N
  Top 0.152: C14.2 64.4,55.78 64.4,58.01 64.49,58.1 64.49,58.8 IC1.4 64.54,59.89 64.05,60.37 J2.23
TMDS_D0_C_P
  Top 0.152: C15.2 64.12,55.3 64.12,57.54 63.61,58.05 63.61,58.78 IC1.6 63.54,59.95 63.79,60.2 63.79,60.24 63.78,60.25 63.78,60.93 63.55,61.15 J2.24
TMDS_D0_N
  Top 0.152: C14.1 65.16,53.56 64.52,52.92 64.52,51.72 64.33,51.53 64.23,51.53 63.75,51.05 J1.39
TMDS_D0_P
  Top 0.152: C15.1 63.84,53.47 64.24,53.08 64.24,51.94 64.11,51.81 64.01,51.81 63.25,51.05 J1.41
TMDS_D1_C_N
  Top 0.152: C12.2 62.47,55.04 62.47,57.63 63.04,58.2 IC1.7 63.04,59.99 62.55,60.48 J2.26
TMDS_D1_C_P
  Top 0.152: C13.2 62.19,56 62.19,57.79 62.11,57.87 62.11,58.77 IC1.9 62.04,59.92 62.29,60.18 62.29,60.34 62.27,60.36 62.27,60.86 62.05,61.07 J2.27
TMDS_D1_N
  Top 0.152: J1.53 60.25,51.38 60.36,51.49 60.36,51.73 61.49,52.86 62.11,52.86 62.5,53.24 C12.1
TMDS_D1_P  (via drill 0.2)
  Top 0.152: J1.51 60.75,51.38 60.64,51.49 60.64,51.61 61.36,52.34 v61.45,52.25 | v61.15,53.09 61.2,53.14 C13.1
  Bottom 0.152: v61.45,52.25 61.45,52.79 v61.15,53.09
TMDS_D2_C1_N
  Top 0.152: C10.2 59.41,55.52 59.41,55.94 61.54,58.07 IC1.10 61.54,59.86 61.05,60.35 J2.29
TMDS_D2_C_P
  Top 0.152: C11.2 59.12,55.55 59.12,56.05 60.61,57.55 60.61,58.77 IC1.12 60.54,59.87 60.77,60.1 60.77,60.86 60.55,61.08 J2.30
TMDS_D2_N
  Top 0.152: C10.1 59.91,53.6 59.26,52.95 59.26,51.54 59.26,50.21 J1.57
TMDS_D2_P
  Top 0.152: C11.1 58.61,53.32 58.98,52.95 58.98,51.54 58.75,51.31 J1.59
UART1_RX  (via drill 0.2)
  Top 0.152: J7.15 11.25,9.92 v11.26,9.93 | v11.98,39.86 11.98,41.97 J1.238
  Bottom 0.152: v11.26,9.93 11.26,39.14 v11.98,39.86
UART1_TX  (via drill 0.2)
  Top 0.152: J7.16 11.77,9.42 v11.82,9.48 | J1.236 12.5,39.57 v12.08,39.14
  Bottom 0.152: v12.08,39.14 12.08,13.08 11.67,12.68 11.67,10.34 11.82,10.19 v11.82,9.48
UART3_RXD  (via drill 0.2)
  Top 0.152: v13.55,9.17 13.3,8.92 J7.17 | J1.105 47.25,47.82 47.3,47.77 47.3,47.44 46.12,46.26 v41.64,46.26
  Bottom 0.152: v41.64,46.26 36.97,41.58 36.97,32.59 v13.55,9.17
UART3_TXD  (via drill 0.2)
  Top 0.152: J1.99 48.58,50.03 48.58,48.32 45.76,45.49 v41.64,45.49 | v13.5,8.41 J7.18
  Bottom 0.152: v41.64,45.49 38.29,42.14 38.29,33.2 v13.5,8.41
USB0(OTG)_D_N  (via drill 0.2)
  Top 0.203: J1.109 46.25,48.92 46.16,48.83 46.16,48.14 v46.28,48.03 | v65.97,5.41 66.08,5.52 66.08,6.28 65.93,6.43 J5.5
  Bottom 0.203: v65.97,5.41 66.08,5.3 66.08,4.91 65.92,4.75 59.88,4.75 51.73,12.91 50.66,13.98 arc-90 50.66,14.34 50.81,14.5 arc90 50.81,14.87 50.26,15.43 arc90 49.89,15.43 49.73,15.27 arc-90 49.36,15.27 46.42,18.21 46.42,47.69 46.28,47.83 v46.28,48.03
USB0(OTG)_D_P  (via drill 0.2)
  Top 0.203: J1.111 45.75,48.92 45.84,48.83 45.84,48.14 v45.72,48.03 | v66.52,5.41 66.41,5.52 66.41,6.95 J5.6
  Bottom 0.203: v45.72,48.03 45.72,47.88 46.09,47.52 46.09,18.08 49.13,15.03 50.42,13.74 51.4,12.77 59.74,4.42 66.06,4.42 66.41,4.77 66.41,5.3 v66.52,5.41
USB1_D_N  (via drill 0.2)
  Top 0.203: J1.115 44.75,48.92 44.66,48.83 44.66,48.09 v44.78,47.98 | v52.96,5.67 53.07,5.78 53.07,6.93 J3.5
  Bottom 0.203: v44.78,47.98 44.66,47.87 44.66,11.23 arc90 44.92,10.97 45.19,10.97 arc-90 45.45,10.71 45.45,10.05 arc-90 45.19,9.79 44.92,9.79 arc90 44.66,9.53 44.66,7.27 47.03,4.91 52.72,4.91 53.07,5.26 53.07,5.56 v52.96,5.67
USB1_D_P  (via drill 0.2)
  Top 0.203: J1.117 44.25,48.92 44.34,48.83 44.34,48.09 v44.22,47.98 | v53.51,5.67 53.4,5.78 53.4,6.18 53.53,6.3 J3.6
  Bottom 0.203: v44.22,47.98 44.34,47.87 44.34,11.23 44.34,9.53 44.34,7.13 46.89,4.57 52.85,4.57 53.4,5.12 53.4,5.56 v53.51,5.67
USB2_D_N  (via drill 0.2)
  Top 0.203: J1.121 43.25,48.92 43.16,48.83 43.16,48.09 v43.28,47.98 | v40.24,5.52 40.24,5.57 40.4,5.73 40.4,6.95 J4.5
  Bottom 0.203: v43.28,47.98 43.16,47.87 43.16,15.05 43.17,15.05 43.17,12.32 43.17,10.47 43.17,5.48 42.06,4.37 41,4.37 40.35,5.02 40.35,5.4 v40.24,5.52
USB2_D_P  (via drill 0.2)
  Top 0.203: J1.123 42.75,48.92 42.84,48.83 42.84,48.09 v42.72,47.98 | v40.79,5.52 40.73,5.57 40.73,6.93 J4.6
  Bottom 0.203: v42.72,47.98 42.84,47.87 42.84,12.32 42.84,12.32 arc-90 42.58,12.06 42.31,12.06 arc90 42.05,11.8 42.05,10.99 arc90 42.31,10.73 42.58,10.73 arc-90 42.84,10.47 42.84,5.62 41.92,4.7 41.13,4.7 40.68,5.16 40.68,5.4 v40.79,5.52
VBUS0
  Top 0.305: J5.2 64.43,9.73 PTC4.2 63.93,9.84 J5.1
VBUS1
  Top 0.305: J3.1 51.03,9.74 PTC3.2 51.53,9.63 J3.2
VBUS2
  Top 0.305: PTC2.2 37.77,10.02 | J4.1 38.33,9.11 37.41,10.02 37.77,10.02 | J4.2 38.83,9.4 38.2,10.02 37.77,10.02
VDD
  Top 1.778: J1.256 7.5,44.32 8.11,44.94 8.11,47.42 7.75,47.79 J1.255
  pour Top (no thermals): 8.88,48.82 8.88,51.92 5.65,51.92 5.65,48.82
  pour Top (no thermals): 8.67,40.64 8.67,43.56 6.03,43.56 6.03,40.64
  pour Top (no thermals): 7.25,54.49 7.25,51.84 9.03,51.84 9.03,54.49

## Text on the board
tPlace: RESET | 5V IN | eDP | HDMI/DP | JLCJLCJLCJLC | RECOVERY | GPIO/Audio | USB 2.0 | USB 2.0 | USB 2.0 | Ethernet
tValues: 1.6mm height safe
tStop: DLT Jetson Nano rev. 2